# EAGLE design servis (EAGLE 9.4.2)
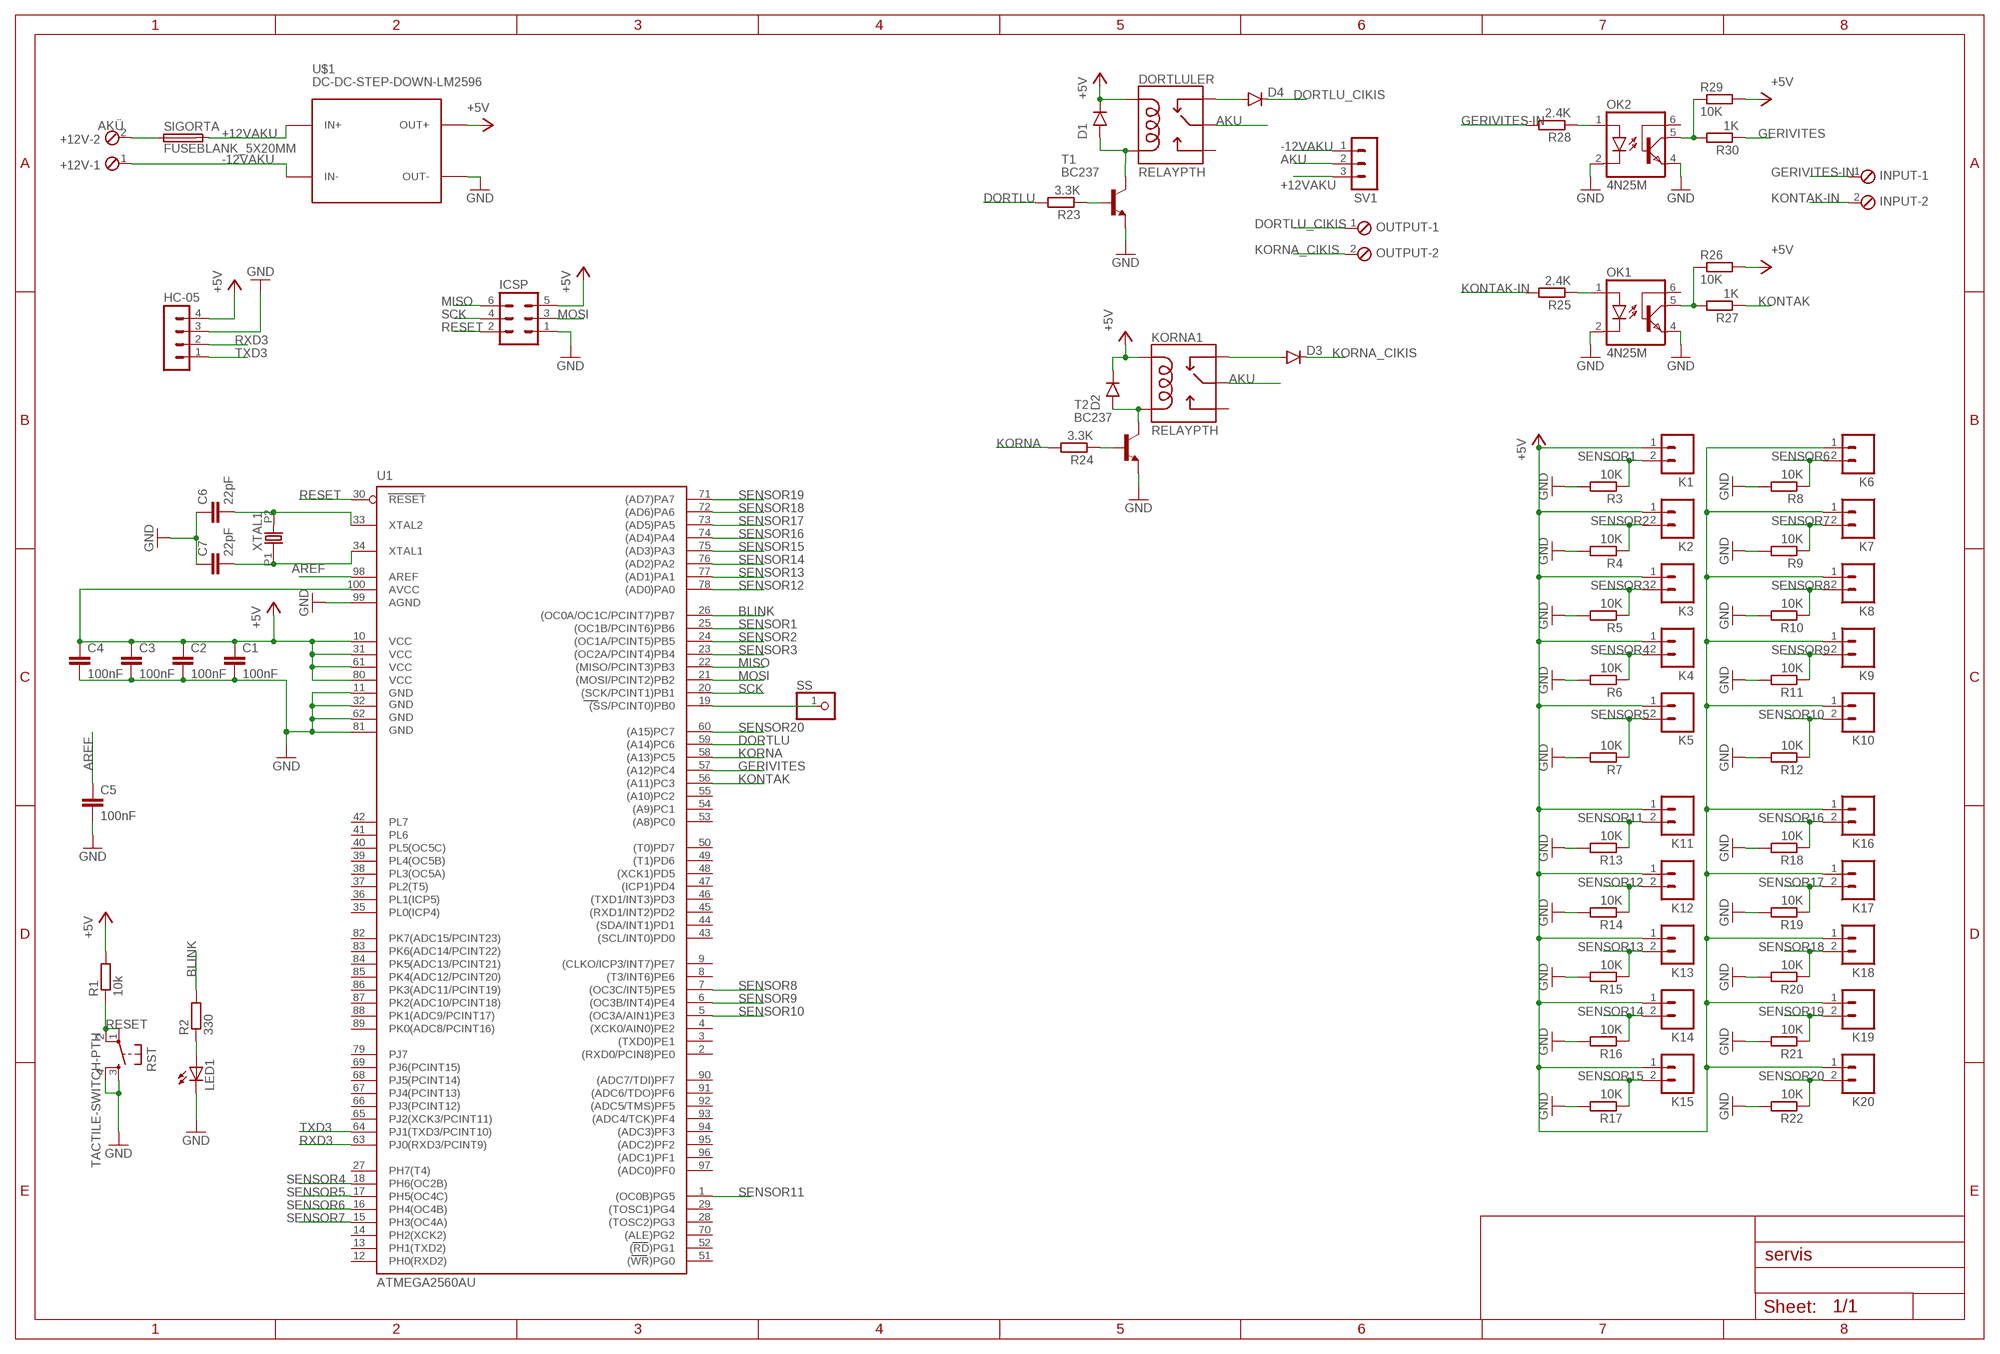
[diagram p0: schematic, sheet 1]

## Parts
+12V  AKÜ  MPT2  [2POL254]
C1  100nF  SPARKFUN_CAP0805  [SPARKFUN_0805]
C2  100nF  SPARKFUN_CAP0805  [SPARKFUN_0805]
C3  100nF  SPARKFUN_CAP0805  [SPARKFUN_0805]
C4  100nF  SPARKFUN_CAP0805  [SPARKFUN_0805]
C5  100nF  SPARKFUN_CAP0805  [SPARKFUN_0805]
C6  22pF  SPARKFUN_CAP0805  [SPARKFUN_0805]
C7  22pF  SPARKFUN_CAP0805  [SPARKFUN_0805]
D1  1N4001  [DO41-10]
D2  1N4001  [DO41-10]
D3  DIODEPTH  [DIODE-1N4001]
D4  DIODEPTH  [DIODE-1N4001]
DORTLULER  RELAYPTH  [SRD-05VDC-SL-C]
HC-05  MA04-1  [MA04-1]
ICSP  MA03-2  [MA03-2]
INPUT  AKÜ  MPT2  [2POL254]
K1  SPARKFUN_M02-JST-2-PTH-NO_SILK  [SPARKFUN_JST-2-PTH-NS]
K2  SPARKFUN_M02-JST-2-PTH-NO_SILK  [SPARKFUN_JST-2-PTH-NS]
K3  SPARKFUN_M02-JST-2-PTH-NO_SILK  [SPARKFUN_JST-2-PTH-NS]
K4  SPARKFUN_M02-JST-2-PTH-NO_SILK  [SPARKFUN_JST-2-PTH-NS]
K5  SPARKFUN_M02-JST-2-PTH-NO_SILK  [SPARKFUN_JST-2-PTH-NS]
K6  SPARKFUN_M02-JST-2-PTH-NO_SILK  [SPARKFUN_JST-2-PTH-NS]
K7  SPARKFUN_M02-JST-2-PTH-NO_SILK  [SPARKFUN_JST-2-PTH-NS]
K8  SPARKFUN_M02-JST-2-PTH-NO_SILK  [SPARKFUN_JST-2-PTH-NS]
K9  SPARKFUN_M02-JST-2-PTH-NO_SILK  [SPARKFUN_JST-2-PTH-NS]
K10  SPARKFUN_M02-JST-2-PTH-NO_SILK  [SPARKFUN_JST-2-PTH-NS]
K11  SPARKFUN_M02-JST-2-PTH-NO_SILK  [SPARKFUN_JST-2-PTH-NS]
K12  SPARKFUN_M02-JST-2-PTH-NO_SILK  [SPARKFUN_JST-2-PTH-NS]
K13  SPARKFUN_M02-JST-2-PTH-NO_SILK  [SPARKFUN_JST-2-PTH-NS]
K14  SPARKFUN_M02-JST-2-PTH-NO_SILK  [SPARKFUN_JST-2-PTH-NS]
K15  SPARKFUN_M02-JST-2-PTH-NO_SILK  [SPARKFUN_JST-2-PTH-NS]
K16  SPARKFUN_M02-JST-2-PTH-NO_SILK  [SPARKFUN_JST-2-PTH-NS]
K17  SPARKFUN_M02-JST-2-PTH-NO_SILK  [SPARKFUN_JST-2-PTH-NS]
K18  SPARKFUN_M02-JST-2-PTH-NO_SILK  [SPARKFUN_JST-2-PTH-NS]
K19  SPARKFUN_M02-JST-2-PTH-NO_SILK  [SPARKFUN_JST-2-PTH-NS]
K20  SPARKFUN_M02-JST-2-PTH-NO_SILK  [SPARKFUN_JST-2-PTH-NS]
KORNA1  RELAYPTH  [SRD-05VDC-SL-C]
LED1  SPARKFUN_LED3MM  [SPARKFUN_LED3MM]
OK1  4N25M  [DIL06]
OK2  4N25M  [DIL06]
OUTPUT  AKÜ  MPT2  [2POL254]
R1  10k  RESISTORR805-0805  [R805]
R2  330  RESISTORR805-0805  [R805]
R3  10K  RESISTORR805-0805  [R805]
R4  10K  RESISTORR805-0805  [R805]
R5  10K  RESISTORR805-0805  [R805]
R6  10K  RESISTORR805-0805  [R805]
R7  10K  RESISTORR805-0805  [R805]
R8  10K  RESISTORR805-0805  [R805]
R9  10K  RESISTORR805-0805  [R805]
R10  10K  RESISTORR805-0805  [R805]
R11  10K  RESISTORR805-0805  [R805]
R12  10K  RESISTORR805-0805  [R805]
R13  10K  RESISTORR805-0805  [R805]
R14  10K  RESISTORR805-0805  [R805]
R15  10K  RESISTORR805-0805  [R805]
R16  10K  RESISTORR805-0805  [R805]
R17  10K  RESISTORR805-0805  [R805]
R18  10K  RESISTORR805-0805  [R805]
R19  10K  RESISTORR805-0805  [R805]
R20  10K  RESISTORR805-0805  [R805]
R21  10K  RESISTORR805-0805  [R805]
R22  10K  RESISTORR805-0805  [R805]
R23  3.3K  RESISTORR805-0805  [R805]
R24  3.3K  RESISTORR805-0805  [R805]
R25  2.4K  RESISTORR805-0805  [R805]
R26  10K  RESISTORR805-0805  [R805]
R27  1K  RESISTORR805-0805  [R805]
R28  2.4K  RESISTORR805-0805  [R805]
R29  10K  RESISTORR805-0805  [R805]
R30  1K  RESISTORR805-0805  [R805]
RST  TACTILE-SWITCH-PTH  [TAC-SWITCH-PTH]
SIGORTA  FUSEBLANK_5X20MM  [FUSE_HOLDER_5X20MM]
SS  PINHD-1X1  [1X01]
SV1  MA03-1  [MA03-1]
T1  BC237  [TO92]
T2  BC237  [TO92]
U1  ATMEGA2560AU  [TQFP100]
U$1  DC-DC-STEP-DOWN-LM2596  [DC-DC-STEP-DOWN-LM2596]
XTAL1  OSC-XTAL-HC-49U-PTH  [HC-49U-PTH]

## Nets
+5V: C1.1 C2.1 C3.1 C4.1 D1.C(CATHODE) D2.C(CATHODE) DORTLULER.COIL1 HC-05.4 ICSP.5 K1.1 K2.1 K3.1 K4.1 K5.1 K6.1 K7.1 K8.1 K9.1 K10.1 K11.1 K12.1 K13.1 K14.1 K15.1 K16.1 K17.1 K18.1 K19.1 K20.1 KORNA1.COIL1 R1.2 R26.2 R29.2 U1.10(VCC) U1.31(VCC1) U1.61(VCC2) U1.80(VCC3) U1.100(AVCC) U$1.OUT+
+12VAKU: SIGORTA.2 SV1.3 U$1.IN+
-12VAKU: +12V.1 SV1.1 U$1.IN-
AKU: DORTLULER.SWCOMMON KORNA1.SWCOMMON SV1.2
AREF: C5.1 U1.98(AREF)
BLINK: R2.2 U1.26((OC0A/OC1C/PCINT7)PB7)
DORTLU: R23.2 U1.59((A14)PC6)
DORTLU_CIKIS: D4.C OUTPUT.1
GERIVITES: R30.1 U1.57((A12)PC4)
GERIVITES-IN: INPUT.1 R28.2
GND: C1.2 C2.2 C3.2 C4.2 C5.2 C6.1 C7.1 HC-05.3 ICSP.1 LED1.K(C) OK1.2(C) OK1.4(EMI) OK2.2(C) OK2.4(EMI) R3.2 R4.2 R5.2 R6.2 R7.2 R8.2 R9.2 R10.2 R11.2 R12.2 R13.2 R14.2 R15.2 R16.2 R17.2 R18.2 R19.2 R20.2 R21.2 R22.2 RST.3 RST.4 T1.1(E) T2.1(E) U1.11(GND) U1.32(GND1) U1.62(GND2) U1.81(GND3) U1.99(AGND) U$1.OUT-
KONTAK: R27.1 U1.56((A11)PC3)
KONTAK-IN: INPUT.2 R25.2
KORNA: R24.2 U1.58((A13)PC5)
KORNA_CIKIS: D3.C OUTPUT.2
KRISTAL: C6.2 U1.33(XTAL2) XTAL1.P2
KRISTAL_2: C7.2 U1.34(XTAL1) XTAL1.P1
MISO: ICSP.6 U1.22((MISO/PCINT3)PB3)
MOSI: ICSP.3 U1.21((MOSI/PCINT2)PB2)
N$1: R23.1 T1.2(B)
N$2: D3.A KORNA1.SWCLOSED(SWCLOSE)
N$3: D4.A DORTLULER.SWCLOSED(SWCLOSE)
N$4: LED1.A R2.1
N$5: SS.1 U1.19((SS/PCINT0)PB0)
N$8: R24.1 T2.2(B)
N$9: D1.A(ANODE) DORTLULER.COIL0 T1.3(C)
N$11: D2.A(ANODE) KORNA1.COIL0 T2.3(C)
N$12: OK1.1(A) R25.1
N$13: OK1.5(COL) R26.1 R27.2
N$14: +12V.2 SIGORTA.1
N$15: OK2.1(A) R28.1
N$16: OK2.5(COL) R29.1 R30.2
RESET: ICSP.2 R1.1 RST.1 RST.2 U1.30(RESET)
RXD3: HC-05.2 U1.63(PJ0(RXD3/PCINT9))
SCK: ICSP.4 U1.20((SCK/PCINT1)PB1)
SENSOR1: K1.2 R3.1 U1.25((OC1B/PCINT6)PB6)
SENSOR2: K2.2 R4.1 U1.24((OC1A/PCINT5)PB5)
SENSOR3: K3.2 R5.1 U1.23((OC2A/PCINT4)PB4)
SENSOR4: K4.2 R6.1 U1.18(PH6(OC2B))
SENSOR5: K5.2 R7.1 U1.17(PH5(OC4C))
SENSOR6: K6.2 R8.1 U1.16(PH4(OC4B))
SENSOR7: K7.2 R9.1 U1.15(PH3(OC4A))
SENSOR8: K8.2 R10.1 U1.7((OC3C/INT5)PE5)
SENSOR9: K9.2 R11.1 U1.6((OC3B/INT4)PE4)
SENSOR10: K10.2 R12.1 U1.5((OC3A/AIN1)PE3)
SENSOR11: K11.2 R13.1 U1.1((OC0B)PG5)
SENSOR12: K12.2 R14.1 U1.78((AD0)PA0)
SENSOR13: K13.2 R15.1 U1.77((AD1)PA1)
SENSOR14: K14.2 R16.1 U1.76((AD2)PA2)
SENSOR15: K15.2 R17.1 U1.75((AD3)PA3)
SENSOR16: K16.2 R18.1 U1.74((AD4)PA4)
SENSOR17: K17.2 R19.1 U1.73((AD5)PA5)
SENSOR18: K18.2 R20.1 U1.72((AD6)PA6)
SENSOR19: K19.2 R21.1 U1.71((AD7)PA7)
SENSOR20: K20.2 R22.1 U1.60((A15)PC7)
TXD3: HC-05.1 U1.64(PJ1(TXD3/PCINT10))
Unconnected: DORTLULER.SWOPEN KORNA1.SWOPEN OK1.6(BAS) OK2.6(BAS) U1.2((RXD0/PCIN8)PE0) U1.3((TXD0)PE1) U1.4((XCK0/AIN0)PE2) U1.8((T3/INT6)PE6) U1.9((CLKO/ICP3/INT7)PE7) U1.12(PH0(RXD2)) U1.13(PH1(TXD2)) U1.14(PH2(XCK2)) U1.27(PH7(T4)) U1.28((TOSC2)PG3) U1.29((TOSC1)PG4) U1.35(PL0(ICP4)) U1.36(PL1(ICP5)) U1.37(PL2(T5)) U1.38(PL3(OC5A)) U1.39(PL4(OC5B)) U1.40(PL5(OC5C)) U1.41(PL6) U1.42(PL7) U1.43((SCL/INT0)PD0) U1.44((SDA/INT1)PD1) U1.45((RXD1/INT2)PD2) U1.46((TXD1/INT3)PD3) U1.47((ICP1)PD4) U1.48((XCK1)PD5) U1.49((T1)PD6) U1.50((T0)PD7) U1.51((WR)PG0) U1.52((RD)PG1) U1.53((A8)PC0) U1.54((A9)PC1) U1.55((A10)PC2) U1.65(PJ2(XCK3/PCINT11)) U1.66(PJ3(PCINT12)) U1.67(PJ4(PCINT13)) U1.68(PJ5(PCINT14)) U1.69(PJ6(PCINT15)) U1.70((ALE)PG2) U1.79(PJ7) U1.82(PK7(ADC15/PCINT23)) U1.83(PK6(ADC14/PCINT22)) U1.84(PK5(ADC13/PCINT21)) U1.85(PK4(ADC12/PCINT20)) U1.86(PK3(ADC11/PCINT19)) U1.87(PK2(ADC10/PCINT18)) U1.88(PK1(ADC9/PCINT17)) U1.89(PK0(ADC8/PCINT16)) U1.90((ADC7/TDI)PF7) U1.91((ADC6/TDO)PF6) U1.92((ADC5/TMS)PF5) U1.93((ADC4/TCK)PF4) U1.94((ADC3)PF3) U1.95((ADC2)PF2) U1.96((ADC1)PF1) U1.97((ADC0)PF0)

## Library data of the parts
+12V INPUT OUTPUT = con-phoenix-254:MPT2: PHOENIX CONNECTOR; OC_FARNELL: unknown; OC_NEWARK: unknown
C1-C7 = DECADE-libraries20151104:SPARKFUN_CAP: Capacitor Standard 0603 ceramic capacitor, and 0.1" leaded capacitor.
D1 D2 = tango:1N4001: DIODE general purpose rectifier, 1 A
D3 D4 = BeagleBone_Blue_R3:DIODE: Diode These are standard reverse protection diodes and small signal diodes. SMA package can handle up to about 1A. SOD-323 can handle about 200mA. What the SOD-323 package when ordering, there are some mfgs out there that are 5-pin packages.
DORTLULER KORNA1 = SRD-05VDC-SL-C:RELAY: SPDT relay (COM-00101)
HC-05 = con-lstb:MA04-1: PIN HEADER; OC_FARNELL: unknown; OC_NEWARK: unknown
ICSP = con-lstb:MA03-2: PIN HEADER; OC_FARNELL: unknown; OC_NEWARK: unknown
K1-K20 = antduino:SPARKFUN_M02: Header 2 Standard 2-pin 0.1" header. Use with straight break away headers (SKU : PRT-00116), right angle break away headers (PRT-00553), swiss pins (PRT-00743), machine pins (PRT-00117), and female headers (PRT-00115). Molex polarized connector foot print use with SKU : PRT-08233 with associated crimp pins and housings.
LED1 = antduino:SPARKFUN_LED: LEDs Standard schematic elements and footprints for 5mm, 3mm, 1206, and 0603 sized LEDs. 5mm - Spark Fun Electronics SKU : COM-00529 (and others)
OK1 OK2 = optocoupler:4N*?M: General Purpose 6-Pin Phototransistor Optocouplers Source: http://www.fairchildsemi.com/ds/4N/4N35-M.pdf; MPN: 4N25-M; OC_FARNELL: 1021349; OC_NEWARK: 98K9084
R1-R30 = dp_devices:RESISTOR
RST = GeekAmmo:TACTILE-SWITCH: Tactile Switch 4 Pins, SPST NO
SIGORTA = fuse:FUSE: Fuse; OC_FARNELL: unknown; OC_NEWARK: unknown
SS = pinhead:PINHD-1X1: PIN HEADER
SV1 = con-lstb:MA03-1: PIN HEADER; OC_FARNELL: unknown; OC_NEWARK: unknown
T1 T2 = transistor:BC237: NPN TRANSISTOR
U1 = SparkFun:ATMEGA2560: MICROCONTROLLER 64/128/256 Kbytes FLASH 4 Kbytes EEPROM 8 Kbytes SRAM 86 General Purpose I/O pins 12-channels16-bit PWM 4 x Serial USARTs 16-channels 10-bit A/D
U$1 = diy-modules:DC-DC-STEP-DOWN-LM2596: DC/DC Step-Down Regulator based on LM2596-ADJ chip
XTAL1 = dp_devices:OSC-XTAL

## Board
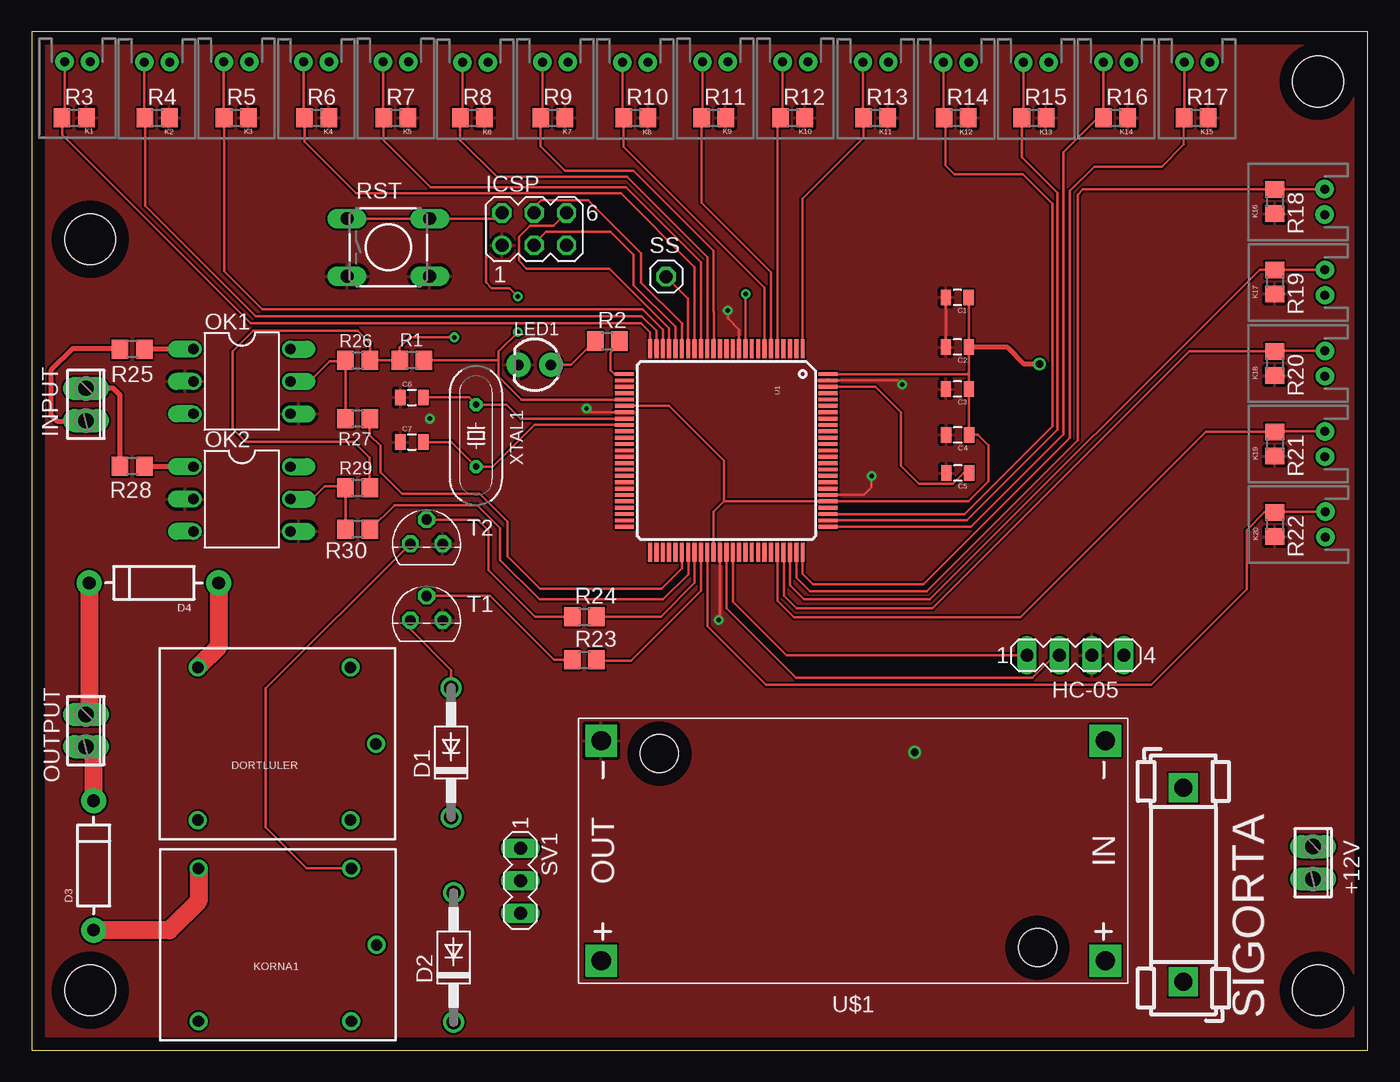
[diagram p1: board, top side]
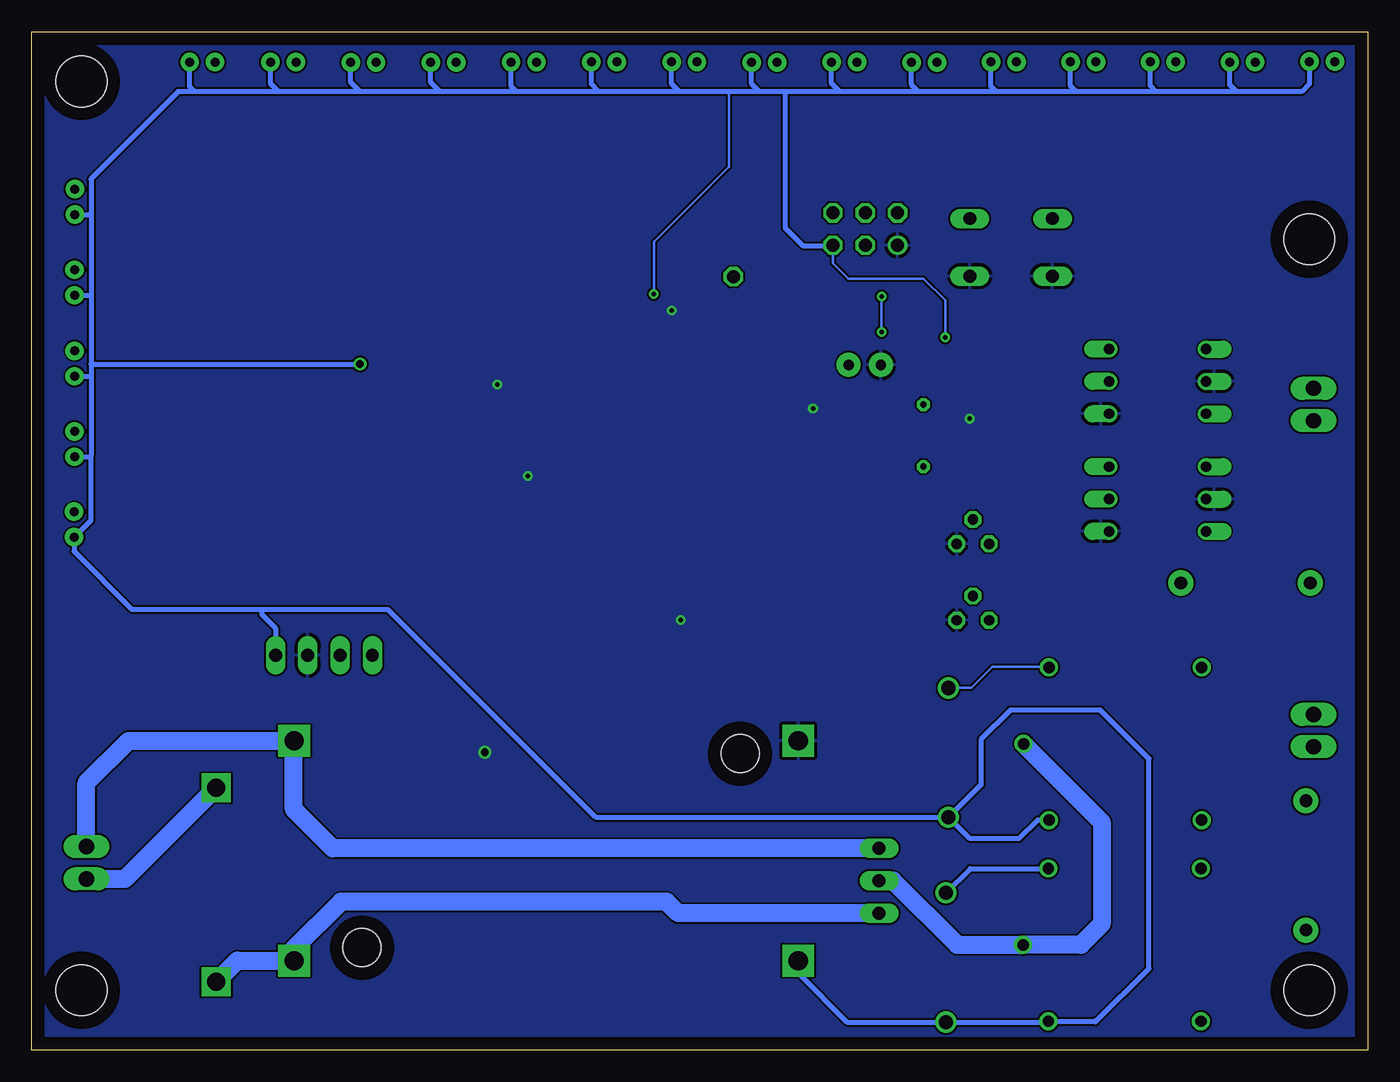
[diagram p2: board, bottom side, seen from below]

Size 105 x 80 mm. Coordinates in mm from the lower left corner, seen from the top.
Outline: 0,80 0,0 105,0 105,80 0,80
Copper layers (1*16): Top 0.035mm / dielectric 1.5mm / Bottom 0.035mm
Design rules "default": minimum track width 6mil, minimum drill 0.35mm, track to track 6mil, track to pad 6mil, pad to pad 6mil, via to via 6mil, smd to smd 6mil, copper to edge 40mil, drill to drill 6mil, minimum pad ring 10mil, minimum via ring 8mil, stop-mask expansion 4mil, vias tented up to drill 0mil, thermal gap 10mil
Holes 4 mm at 4.6,63.7 4.6,4.7 101.1,4.7 101.1,76.1

### Footprints (pad centres in the part's own frame; a part is rotated, then mirrored left to right if it is on the bottom)
2POL254 = drill 1.2 long: 1 -1.27,0; 2 1.27,0
SPARKFUN_0805 = smd 0.8 x 1.2: 1 -0.9,0; 2 0.9,0
DO41-10 = drill 1.118: A 5.08,0; C -5.08,0
DIODE-1N4001 = drill 1 pad 1.981: A -5.08,0; C 5.08,0
SRD-05VDC-SL-C = drill 0.9: COIL0 -5.39,-6.12; COIL1 -5.39,5.88; SWCLOSED 6.61,-6.12; SWCOMMON -7.39,-0.12; SWOPEN 6.61,5.88
MA04-1 = drill 1.016 long: 1 -3.81,0; 2 -1.27,0; 3 1.27,0; 4 3.81,0
MA03-2 = drill 1.016: 1 -2.54,-1.27 | drill 1.016 octagon: 2 -2.54,1.27; 3 0,-1.27; 4 0,1.27; 5 2.54,-1.27; 6 2.54,1.27
SPARKFUN_JST-2-PTH-NS = drill 0.7 pad 1.448: 1 -1,0; 2 1,0
SPARKFUN_LED3MM = drill 0.813 pad 1.88: A -1.27,0; K 1.27,0
DIL06 = drill 0.813 offset: 1 -2.54,-3.81; 2 0,-3.81; 3 2.54,-3.81; 4 2.54,3.81; 5 0,3.81; 6 -2.54,3.81
R805 = smd 1.3 x 1.5: 1 -0.95,0; 2 0.95,0
TAC-SWITCH-PTH = drill 1.016 pad 1.524 long: 1 -3.251,2.261; 2 3.251,2.261; 3 -3.251,-2.261; 4 3.251,-2.261
FUSE_HOLDER_5X20MM = drill 1.422 pad 2.286 square: 1 0,0; 2 15.24,0
1X01 = drill 1.016 octagon: 1 0,0
MA03-1 = drill 1.016 long: 1 -2.54,0; 2 0,0; 3 2.54,0
TO92 = drill 0.813 octagon: 1 1.27,0; 2 0,1.905; 3 -1.27,0
TQFP100 = smd 1.5 x 0.3: 1 -8,6; 2 -8,5.5; 3 -8,5; 4 -8,4.5; 5 -8,4; 6 -8,3.5; 7 -8,3; 8 -8,2.5; 9 -8,2; 10 -8,1.5; 11 -8,1; 12 -8,0.5; 13 -8,0; 14 -8,-0.5; 15 -8,-1; 16 -8,-1.5; 17 -8,-2; 18 -8,-2.5; 19 -8,-3; 20 -8,-3.5; 21 -8,-4; 22 -8,-4.5; 23 -8,-5; 24 -8,-5.5; 25 -8,-6; 51 8,-6; 52 8,-5.5; 53 8,-5; 54 8,-4.5; 55 8,-4; 56 8,-3.5; 57 8,-3; 58 8,-2.5; 59 8,-2; 60 8,-1.5; 61 8,-1; 62 8,-0.5; 63 8,0; 64 8,0.5; 65 8,1; 66 8,1.5; 67 8,2; 68 8,2.5; 69 8,3; 70 8,3.5; 71 8,4; 72 8,4.5; 73 8,5; 74 8,5.5; 75 8,6 | smd 0.3 x 1.5: 26 -6,-8; 27 -5.5,-8; 28 -5,-8; 29 -4.5,-8; 30 -4,-8; 31 -3.5,-8; 32 -3,-8; 33 -2.5,-8; 34 -2,-8; 35 -1.5,-8; 36 -1,-8; 37 -0.5,-8; 38 0,-8; 39 0.5,-8; 40 1,-8; 41 1.5,-8; 42 2,-8; 43 2.5,-8; 44 3,-8; 45 3.5,-8; 46 4,-8; 47 4.5,-8; 48 5,-8; 49 5.5,-8; 50 6,-8; 76 6,8; 77 5.5,8; 78 5,8; 79 4.5,8; 80 4,8; 81 3.5,8; 82 3,8; 83 2.5,8; 84 2,8; 85 1.5,8; 86 1,8; 87 0.5,8; 88 0,8; 89 -0.5,8; 90 -1,8; 91 -1.5,8; 92 -2,8; 93 -2.5,8; 94 -3,8; 95 -3.5,8; 96 -4,8; 97 -4.5,8; 98 -5,8; 99 -5.5,8; 100 -6,8
DC-DC-STEP-DOWN-LM2596 = drill 1.5 pad 2.5 square: IN+ -19.812,8.636; IN- -19.812,-8.636; OUT+ 19.812,8.636; OUT- 19.812,-8.636 | hole 3: -14.478,7.62; 15.24,-7.62
HC-49U-PTH = drill 0.508 octagon: P1 -2.44,0; P2 2.44,0

### Placement (x,y rotation side)
+12V  100.71,14.71 270 top
C1  72.74,59.13 180 top
C2  72.75,55.23 180 top
C3  72.76,51.93 180 top
C4  72.77,48.33 180 top
C5  72.78,45.33 180 top
C6  29.87,51.27 0 top
C7  29.87,47.77 0 top
D1  32.95,23.37 90 top
D2  33.15,7.27 90 top
D3  4.86,14.5 90 top
D4  9.6,36.7 180 top
DORTLULER  19.66,23.94 180 top
HC-05  82.04,31.02 0 top
ICSP  39.49,64.5 0 top
INPUT  4.25,50.72 270 top
K1  3.58,77.66 180 top
K2  9.84,77.62 180 top
K3  16.09,77.64 180 top
K4  22.36,77.63 180 top
K5  28.61,77.64 180 top
K6  34.85,77.6 180 top
K7  41.14,77.62 180 top
K8  47.42,77.6 180 top
K9  53.72,77.64 180 top
K10  60.02,77.64 180 top
K11  66.33,77.62 180 top
K12  72.64,77.61 180 top
K13  78.94,77.61 180 top
K14  85.24,77.62 180 top
K15  91.59,77.62 180 top
K16  101.62,66.64 90 top
K17  101.64,60.3 90 top
K18  101.63,53.94 90 top
K19  101.64,47.61 90 top
K20  101.67,41.29 90 top
KORNA1  19.71,8.14 180 top
LED1  39.53,53.83 180 top
OK1  16.51,52.53 270 top
OK2  16.51,43.29 270 top
OUTPUT  4.25,25.1 270 top
R1  29.87,54.19 180 top
R2  45.23,55.71 0 top
R3  3.33,73.24 0 top
R4  9.85,73.24 0 top
R5  16.07,73.24 0 top
R6  22.39,73.24 0 top
R7  28.61,73.24 0 top
R8  34.63,73.24 0 top
R9  40.95,73.24 0 top
R10  47.47,73.24 0 top
R11  53.59,73.24 0 top
R12  59.81,73.24 0 top
R13  66.33,73.24 0 top
R14  72.65,73.24 0 top
R15  78.77,73.24 0 top
R16  85.19,73.24 0 top
R17  91.51,73.24 0 top
R18  97.69,66.67 270 top
R19  97.69,60.35 270 top
R20  97.69,53.93 270 top
R21  97.69,47.61 270 top
R22  97.69,41.29 270 top
R23  43.43,30.65 0 top
R24  43.43,34.05 0 top
R25  7.89,55.06 180 top
R26  25.61,54.19 0 top
R27  25.61,49.61 180 top
R28  7.89,45.86 180 top
R29  25.61,44.19 0 top
R30  25.61,40.91 180 top
RST  28.02,63.07 0 top
SIGORTA  90.51,20.6 270 top
SS  49.86,60.77 0 top
SV1  38.4,13.3 270 top
T1  31.03,33.77 0 top
T2  31.03,39.77 0 top
U1  54.59,47.11 270 top
U$1  64.57,15.66 180 top
XTAL1  34.92,48.27 90 top

### Tracks (layer width: path | path; a pad name or v marks a point on that pad's centre or on a via)
+5V  (via drill 0.35, 0.6)
  Top 0.2: C1.1 C2.1 73.65,53.2 | 73.65,53.2 C3.1 C4.1 74.37,48.33 75.2,47.5 75.2,44.7 73.61,43.11 U1.80 54.4,43.1 | U1.100 73.56,53.11 73.65,53.2 | U1.61 53.59,42.29 54.4,43.1 | U1.31 50.09,50.61 54.4,46.3 54.4,43.1 | R26.2 26.6,54.19 | 26.6,54.19 R1.2 28.92,55.22 29.7,56 v33.2,56 | R29.2 26.56,46.54 25.3,47.8 16.8,47.8 15.8,48.8 15.8,54.9 17.4,56.5 25.6,56.5 26.6,55.5 26.6,54.19 | U1.10 v56.1,59.4
  Top 0.4: v79.2,53.9 78,53.9 76.7,55.2 73.68,55.2 C2.1
  Bottom 0.2: ICSP.5 42.03,61.83 40.8,60.6 34.9,60.6 33.2,58.9 v33.2,56 | 50.2,75.3 50.2,69.4 56.1,63.5 v56.1,59.4
  Bottom 0.4: U$1.OUT+ 44.76,6.02 40.92,2.19 D2.C 25.17,2.19 KORNA1.COIL1 21.46,2.26 21.4,2.2 17.2,6.4 17.2,22.9 21,26.7 28.1,26.7 30.4,24.4 30.4,20.84 D1.C | DORTLULER.COIL1 25.94,18.06 27.4,16.6 31.26,16.6 D1.C | HC-05.4 85.85,33.15 86.9,34.2 86.9,34.6 | K1.1 4.58,75.92 5.2,75.3 10.3,75.3 | 10.3,75.3 10.84,75.84 K2.1 | 10.3,75.3 16.6,75.3 | K3.1 17.09,75.79 16.6,75.3 | 16.6,75.3 22.9,75.3 | 22.9,75.3 23.36,75.76 K4.1 | 22.9,75.3 29.2,75.3 | 29.2,75.3 29.61,75.7 K5.1 | 29.2,75.3 35.3,75.3 | 35.3,75.3 35.85,75.85 K6.1 | 35.3,75.3 41.5,75.3 | 41.5,75.3 42.14,75.94 K7.1 | 41.5,75.3 45.8,75.3 | 45.8,75.3 47.8,75.3 | 47.8,75.3 48.42,75.92 K8.1 | 47.8,75.3 50.2,75.3 54.1,75.3 | K9.1 54.72,75.92 54.1,75.3 | 54.1,75.3 60.4,75.3 | 60.4,75.3 61.02,75.92 K10.1 | 60.4,75.3 66.9,75.3 | 66.9,75.3 67.33,75.73 K11.1 | 66.9,75.3 72.9,75.3 | 72.9,75.3 73.64,76.04 K12.1 | 72.9,75.3 79.2,75.3 | 79.2,75.3 79.94,76.04 K13.1 | 79.2,75.3 85.6,75.3 | 85.6,75.3 86.24,75.94 K14.1 | 85.6,75.3 92.2,75.3 | 92.2,75.3 92.59,75.69 K15.1 | 92.2,75.3 93.5,75.3 100.35,68.45 100.35,65.5 | 86.9,34.6 97.1,34.6 101.67,39.17 K20.1 100.35,41.62 100.35,46.7 | 45.8,75.3 45.8,64.6 44.4,63.2 42.06,63.2 ICSP.5 | 100.35,65.5 100.35,59.3 | 100.35,59.3 100.35,53.9 | 100.35,53.9 100.35,52.9 | 100.35,52.9 100.35,46.7 | 100.35,53.9 v79.2,53.9 | K19.1 100.44,46.61 100.35,46.7 | K18.1 100.39,52.94 100.35,52.9 | K17.1 100.35,59.3 | K16.1 100.49,65.64 100.35,65.5 | 86.9,34.6 77,34.6 60.69,18.29 D1.C
+12VAKU
  Bottom 1.4: SIGORTA.2 88.84,7.02 U$1.IN+ 84.38,7.98 80.7,11.66 55.1,11.66 54.2,10.76 SV1.3
-12VAKU
  Bottom 1.4: +12V.1 100.71,20.98 97.4,24.3 U$1.IN- 84.4,24.28 84.4,18.9 81.34,15.84 SV1.1
AKU
  Bottom 1.4: SV1.2 37.3,13.3 32.26,8.26 KORNA1.SWCOMMON 22.54,8.26 20.9,9.9 20.9,17.91 DORTLULER.SWCOMMON
AREF
  Top 0.2: C5.1 73.24,45.33 72.39,44.48 69.72,44.48 68.3,45.9 68.3,50.1 66.3,52.1 U1.98
BLINK
  Top 0.2: U1.26 45.79,53.11 45.5,53.4 45.5,54.8 46.18,55.48 R2.2
DORTLU
  Top 0.2: U1.59 52.59,36.09 47.1,30.6 44.43,30.6 R23.2
DORTLU_CIKIS
  Top 1.4: D4.C 4.52,26.64 OUTPUT.1
GERIVITES
  Top 0.2: R30.1 26.61,40.91 28.5,42.8 35,42.8 36.8,41 36.8,38.5 39.9,35.4 49.6,35.4 51.6,37.4 U1.57
GERIVITES-IN
  Top 0.4: INPUT.1 6.41,51.99 6.94,51.46 R28.2
GND  (via drill 0.35, 0.6)
  Top 0.2: C1.2 C2.2 | U1.32 43.89,50.11 v43.6,50.4 | U1.99 68.09,52.61 v68.4,52.3 | U1.11 55.59,56.61 54.7,57.5 v54.7,58.1 | U1.81 65.41,43.61 66,44.2 v66,45.1 | U1.62 54.09,33.89 v54,33.8
  other vias: 69.4,23.4 31.3,49.6
  pour Top: 0,80 0,0 105,0 105,80
  pour Bottom: 0,80 0,0 105,0 105,80
KONTAK
  Top 0.2: R27.1 26.56,48.31 27.4,47.47 27.4,45.4 29.1,43.7 35.2,43.7 37.4,41.5 37.4,38.8 39.95,36.25 49.5,36.25 51.09,37.84 U1.56
KONTAK-IN
  Top 0.4: R25.2 6.9,55.1 3.2,55.1 1.5,53.4 1.5,49.9 2,49.4 4.2,49.4 INPUT.2
KORNA
  Top 0.2: R24.2 49.45,34.05 52.1,36.7 U1.58
KORNA_CIKIS
  Top 1.4: D3.C 4.86,23.22 OUTPUT.2
KRISTAL
  Top 0.2: C6.2 34.36,51.27 XTAL1.P2 37.32,50.71 38.42,49.61 U1.33
KRISTAL_2
  Top 0.2: U1.34 39.51,49.11 36.23,45.83 XTAL1.P1 32.98,47.77 C7.2
MISO
  Top 0.2: U1.22 50.09,56.71 45.4,61.4 38.9,61.4 38.3,62 38.3,63.9 39.16,64.76 41.02,64.76 ICSP.6
MOSI
  Top 0.2: U1.21 50.59,56.81 47.3,60.1 47.3,62.5 45.5,64.3 40.4,64.3 39.49,63.39 ICSP.3
N$1
  Top 0.2: T1.2 36.02,35.67 41.05,30.65 R23.1
N$2
  Top 1.4: KORNA1.SWCLOSED 13.1,11.7 10.8,9.4 4.88,9.4 D3.A
N$3
  Top 1.4: D4.A 14.68,31.69 DORTLULER.SWCLOSED
N$4
  Top 0.2: R2.1 42.4,53.83 LED1.A
N$5
  Top 0.2: SS.1 51.59,59.04 U1.19
N$8
  Top 0.2: R24.1 39.55,34.05 35.9,37.7 35.9,40.8 35.02,41.67 T2.2
N$9
  Top 0.2: T1.3 29.76,33.04 32.95,29.85 D1.A
  Bottom 0.2: D1.A 31.15,28.45 29.5,30.1 25.09,30.1 DORTLULER.COIL0
N$11
  Top 0.2: T2.3 18.4,28.41 18.4,17.5 21.6,14.3 25.06,14.3 KORNA1.COIL0
  Bottom 0.4: D2.A 31.24,14.26 KORNA1.COIL0
N$12
  Top 0.4: OK1.1 R25.1
N$13
  Top 0.2: OK1.5 21.83,52.53 23.4,54.1 24.57,54.1 R26.1 R27.2
N$14
  Bottom 1.4: +12V.2 97.66,13.44 SIGORTA.1
N$15
  Top 0.4: OK2.1 8.87,45.83 R28.1
N$16
  Top 0.2: OK2.5 21.99,43.29 23,44.3 24.5,44.3 | 24.5,44.3 24.55,44.3 R29.1 | R30.2 24.66,44.14 24.5,44.3
RESET  (via drill 0.35)
  Top 0.2: RST.1 RST.2 35.69,65.33 | ICSP.2 36.51,65.33 35.69,65.33 | 35.69,65.33 35.69,60.31 36.15,59.85 37.55,59.85 v38.2,59.2 | U1.30 38.49,51.11 36.7,52.9 36.7,54.19 | v38.2,56.4 36.7,54.9 36.7,54.19 | R1.1 36.7,54.19
  Bottom 0.2: v38.2,59.2 v38.2,56.4
RXD3
  Top 0.2: HC-05.2 80.43,31.02 78.65,29.24 60.06,29.24 54.6,34.7 U1.63
SCK
  Top 0.2: ICSP.4 39.49,66.27 40.01,66.78 43.72,66.78 47.9,62.6 47.9,60.3 51.09,57.11 U1.20
SENSOR1
  Top 0.2: K1.2 2.58,73.44 R3.1 2.38,71.92 17.2,57.1 47.9,57.1 48.6,56.4 U1.25
SENSOR2
  Top 0.2: K2.2 8.84,73.3 R4.1 8.9,66.34 17.59,57.65 47.94,57.65 49.09,56.5 U1.24
SENSOR3
  Top 0.2: K3.2 15.09,73.27 R5.1 15.12,61.18 18.1,58.2 48,58.2 49.6,56.6 U1.23
SENSOR4
  Top 0.2: K4.2 21.36,73.32 R6.1 21.44,71.36 25.5,67.3 46.3,67.3 52.1,61.5 U1.18
SENSOR5
  Top 0.2: K5.2 27.61,73.3 R7.1 27.66,71.5 31.36,67.8 46.7,67.8 52.6,61.9 U1.17
SENSOR6
  Top 0.2: K6.2 33.85,73.41 R8.1 33.68,71.5 36.58,68.6 46.8,68.6 53.1,62.3 53.1,58 U1.16
SENSOR7
  Top 0.2: K7.2 40.14,73.38 R9.1 40,71 41.9,69.1 47.3,69.1 53.6,62.8 53.6,58 U1.15
SENSOR8
  Top 0.2: K8.2 46.42,73.34 R10.1 46.52,70.98 57.59,59.91 U1.7
SENSOR9
  Top 0.2: K9.2 52.72,73.32 R11.1 52.64,66.56 58.1,61.1 U1.6
SENSOR10
  Top 0.2: K10.2 59.02,73.39 R12.1 58.6,72.98 U1.5
SENSOR11
  Top 0.2: K11.2 65.33,73.29 R13.1 65.38,71.68 60.59,66.89 U1.1
SENSOR12
  Top 0.2: K12.2 71.64,73.3 R14.1 71.8,73.14 71.8,69.5 72.5,68.8 77.9,68.8 80.2,66.5 80.2,49 73.3,42.1 U1.78
SENSOR13
  Top 0.2: K13.2 77.94,73.36 R15.1 77.82,70.14 80.62,67.34 80.62,48.72 73.51,41.61 U1.77
SENSOR14
  Top 0.2: K14.2 R16.1 83.79,73.24 81.1,70.55 81.1,48.4 73.8,41.1 U1.76
SENSOR15
  Top 0.152: 88.8,69.4 90.56,71.16 90.56,72.5
  Top 0.2: K15.2 90.59,73.27 R17.1 90.56,72.5 | U1.75 60.59,37.41 61.4,36.6 70.1,36.6 81.6,48.1 81.6,67.5 83.5,69.4 88.8,69.4
SENSOR16
  Top 0.2: U1.74 60.09,37.11 61.15,36.05 70.35,36.05 82.2,47.9 82.2,67.2 82.62,67.62 R18.1 101.6,67.62 K16.2
SENSOR17
  Top 0.2: K17.2 R19.1 96.5,61.3 70.6,35.4 60.7,35.4 59.59,36.51 U1.73
SENSOR18
  Top 0.2: K18.2 97.75,54.94 R20.1 97.67,54.9 91,54.9 70.8,34.7 60.1,34.7 59.1,35.7 U1.72
SENSOR19
  Top 0.2: K19.2 97.74,48.61 R21.1 92.26,48.56 77.7,34 59.9,34 58.6,35.3 U1.71
SENSOR20
  Top 0.2: K20.2 97.74,42.29 R22.1 96.89,42.24 95.5,40.85 95.5,36.2 88,28.7 57.7,28.7 53.1,33.3 U1.60
TXD3
  Top 0.2: HC-05.1 76.42,31.02 76.4,31 59.3,31 55.1,35.2 U1.64